# EAGLE schematic 245_gas detection (EAGLE 9.6.2)
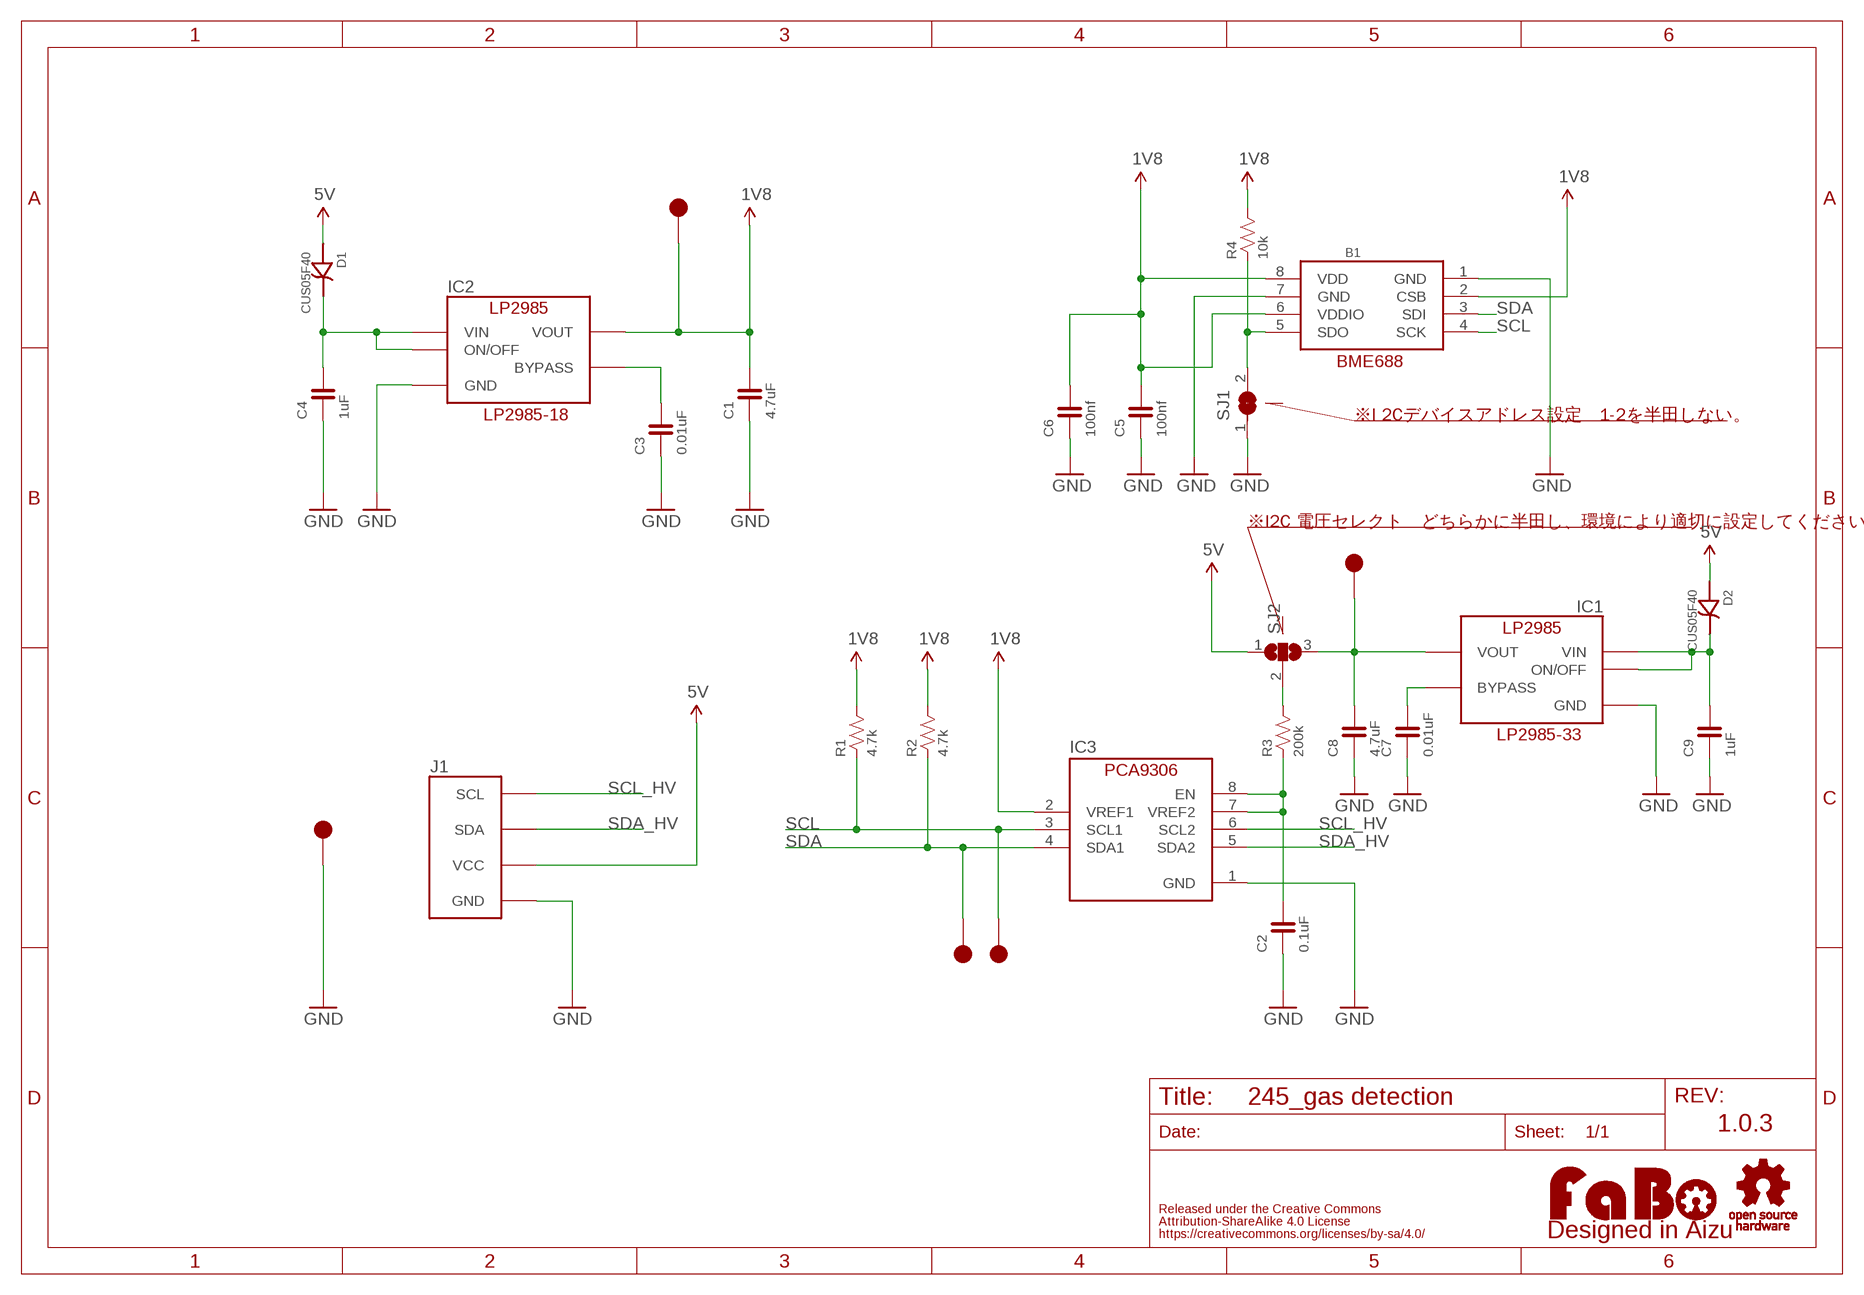
[diagram p0: schematic, sheet 1]

## Parts
B1  BO-BME680  [BOSCH-BME680]
C1  4.7uF  CAPACITOR-0603  [0603]
C2  0.1uF  CAPACITOR-0603  [0603]
C3  0.01uF  CAPACITOR-0603  [0603]
C4  1uF  CAPACITOR-0603  [0603]
C5  100nf  CAPACITOR-0603  [0603]
C6  100nf  CAPACITOR-0603  [0603]
C7  0.01uF  CAPACITOR-0603  [0603]
C8  4.7uF  CAPACITOR-0603  [0603]
C9  1uF  CAPACITOR-0603  [0603]
D1  CUS05F40  [CUS05F40]
D2  CUS05F40  [CUS05F40]
IC1  LP2985-33DBV  [SOT-23-5]
IC2  LP2985-33DBV  [SOT-23-5]
IC3  PCA9306_SSOP  [8PIN-SSOP]
J1  FABO_BRICK_I2C  [FABO_BRICK_I2C]
LOGO1  LOGO_FABO-M  [LOGO_FABO_M]
R1  4.7k  RESISTOR-0603  [0603]
R2  4.7k  RESISTOR-0603  [0603]
R3  200k  RESISTOR-0603  [0603]
R4  10k  RESISTOR-0603  [0603]
SJ1  SJ  [SJ]
SJ2  SJ2W  [SJ_2]
TP1  TP-15  [TP-15]
TP2  TP-15  [TP-15]
TP3  TP-15  [TP-15]
TP4  TP-15  [TP-15]
TP5  TP-15  [TP-15]
U$2  LOGO_OSHW-M_BOTTOM  [LOGO_OSHW_M_BOTTOM]

## Nets
1V8: B1.2(CSB) B1.6(VDDIO) B1.8(VDD) C1.2 C5.2 C6.2 IC2.5(VOUT) IC3.2(VREF1) R1.2 R2.2 R4.2 TP3.1
3V3: C8.2 IC1.5(VOUT) SJ2.3 TP5.1
5V: D1.A(ANODE) D2.A(ANODE) J1.VCC SJ2.1
GND: B1.1(GND) B1.7(GND) C1.1 C2.1 C3.1 C4.1 C5.1 C6.1 C7.1 C8.1 C9.1 IC1.2(GND) IC2.2(GND) IC3.1(GND) J1.GND SJ1.1 TP4.1
N$1: C2.2 IC3.7(VREF2) IC3.8(EN) R3.1
N$2: B1.5(SDO) R4.1 SJ1.2
N$3: C3.2 IC2.4(BYPASS)
N$4: C4.2 D1.C(CATHODE) IC2.1(VIN) IC2.3(ON/OFF)
N$5: R3.2 SJ2.2
N$7: C7.2 IC1.4(BYPASS)
N$8: C9.2 D2.C(CATHODE) IC1.1(VIN) IC1.3(ON/OFF)
SCL: B1.4(SCK) IC3.3(SCL1) R1.1 TP2.1
SCL_HV: IC3.6(SCL2) J1.SCL
SDA: B1.3(SDI) IC3.4(SDA1) R2.1 TP1.1
SDA_HV: IC3.5(SDA2) J1.SDA

## Notes on the sheet
- BME688
- LP2985-18 | ※I 2Cデバイスアドレス設定　1-2を半田しない。
- ※I2C 電圧セレクト　どちらかに半田し、環境により適切に設定してください。
- LP2985-33
- 1.0.3

## Library data of the parts
B1 = FaBo-Mems:BO-BME680
C1-C9 = FaBo-Capacitor:CAPACITOR: CAPACITOR
D1 D2 = FaBo-Diode:CUS05F40
IC1 IC2 = FaBo-Supply:LP2985: LP2985
IC3 = FaBo-LevelTranslator:PCA9306
J1 = FaBo-Template:FABO_BRICK_I2C: FaBo Brick I2C
LOGO1 = component:LOGO_FABO
R1-R4 = FaBo-Resistors:RESISTOR: RESISTOR
SJ1 = jumper:SJ: SMD solder JUMPER
SJ2 = jumper:SJ2W: SMD solder JUMPER
TP1-TP5 = FaBo-Supply:TP
U$2 = FaBo-etc:LOGO_OSHW